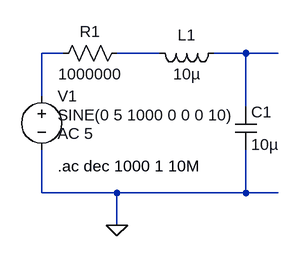
[diagram p0: schematic Objective 3.1.asc]
Objective 3.1.asc, the LTspice schematic file:
Version 4
SHEET 1 880 680
WIRE 96 112 64 112
WIRE 240 112 176 112
WIRE 368 112 320 112
WIRE 416 112 368 112
WIRE 64 176 64 112
WIRE 368 192 368 112
WIRE 64 320 64 256
WIRE 176 320 64 320
WIRE 368 320 368 256
WIRE 368 320 176 320
WIRE 416 320 368 320
WIRE 176 368 176 320
FLAG 176 368 0
SYMBOL res 192 96 R90
WINDOW 0 0 56 VBottom 2
WINDOW 3 32 56 VTop 2
SYMATTR InstName R1
SYMATTR Value 1000000
SYMBOL ind 336 96 R90
WINDOW 0 5 56 VBottom 2
WINDOW 3 32 56 VTop 2
SYMATTR InstName L1
SYMATTR Value 10µ
SYMBOL cap 352 192 R0
SYMATTR InstName C1
SYMATTR Value 10µ
SYMBOL voltage 64 160 R0
WINDOW 3 24 44 Left 2
WINDOW 123 24 72 Left 2
WINDOW 39 0 0 Left 0
SYMATTR InstName V1
SYMATTR Value SINE(0 5 1000 0 0 0 10)
SYMATTR Value2 AC 5
TEXT 88 280 Left 2 !.ac dec 1000 1 10M

The netlist it stands for:
* Objective 3.1.asc
R1 N002 N001 1000000
L1 N003 N002 10µ
C1 N003 0 10µ
V1 N001 0 SINE(0 5 1000 0 0 0 10) AC 5
.ac dec 1000 1 10M
.backanno
.end